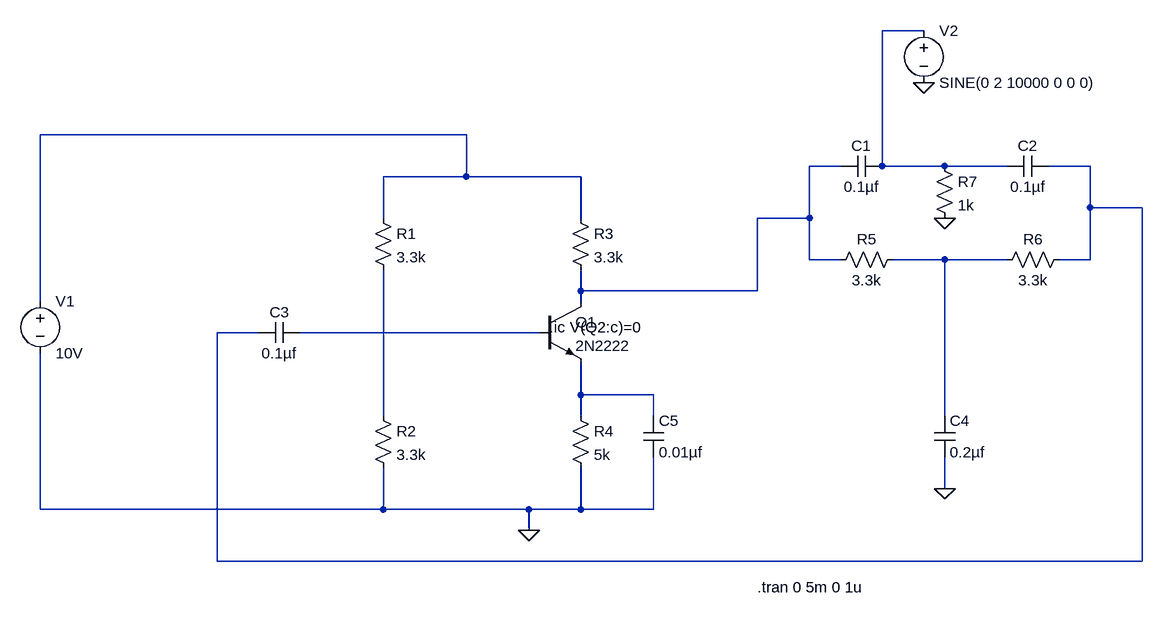
[diagram p0: schematic twin t oscillator.asc]
twin t oscillator.asc, the LTspice schematic file:
Version 4.1
SHEET 1 1504 680
WIRE 1024 -208 960 -208
WIRE 320 -48 -336 -48
WIRE 896 0 848 0
WIRE 960 0 960 -208
WIRE 1056 0 960 0
WIRE 1152 0 1056 0
WIRE 1280 0 1216 0
WIRE 320 16 320 -48
WIRE 320 16 192 16
WIRE 496 16 320 16
WIRE 1280 64 1280 0
WIRE 1360 64 1280 64
WIRE 192 80 192 16
WIRE 496 80 496 16
WIRE 848 80 848 0
WIRE 848 80 768 80
WIRE 848 144 848 80
WIRE 896 144 848 144
WIRE 1056 144 976 144
WIRE 1152 144 1056 144
WIRE 1280 144 1280 64
WIRE 1280 144 1232 144
WIRE 496 192 496 160
WIRE 768 192 768 80
WIRE 768 192 496 192
WIRE -336 208 -336 -48
WIRE 496 208 496 192
WIRE 0 256 -64 256
WIRE 432 256 64 256
WIRE 496 352 496 304
WIRE 608 352 496 352
WIRE 192 384 192 160
WIRE 496 384 496 352
WIRE 608 384 608 352
WIRE 1056 384 1056 144
WIRE 1056 496 1056 448
WIRE -336 528 -336 288
WIRE 192 528 192 464
WIRE 192 528 -336 528
WIRE 416 528 192 528
WIRE 496 528 496 464
WIRE 496 528 416 528
WIRE 608 528 608 448
WIRE 608 528 496 528
WIRE 416 560 416 528
WIRE -64 608 -64 256
WIRE 1360 608 1360 64
WIRE 1360 608 -64 608
FLAG 416 560 0
FLAG 1056 80 0
FLAG 1056 496 0
FLAG 1024 -128 0
SYMBOL res 176 64 R0
SYMATTR InstName R1
SYMATTR Value 3.3k
SYMBOL res 176 368 R0
SYMATTR InstName R2
SYMATTR Value 3.3k
SYMBOL res 480 64 R0
SYMATTR InstName R3
SYMATTR Value 3.3k
SYMBOL res 480 368 R0
SYMATTR InstName R4
SYMATTR Value 5k
SYMBOL res 992 128 R90
WINDOW 0 0 56 VBottom 2
WINDOW 3 32 56 VTop 2
SYMATTR InstName R5
SYMATTR Value 3.3k
SYMBOL res 1248 128 R90
WINDOW 0 0 56 VBottom 2
WINDOW 3 32 56 VTop 2
SYMATTR InstName R6
SYMATTR Value 3.3k
SYMBOL cap 960 -16 R90
WINDOW 0 0 32 VBottom 2
WINDOW 3 32 32 VTop 2
SYMATTR InstName C1
SYMATTR Value 0.1µf
SYMBOL cap 1216 -16 R90
WINDOW 0 0 32 VBottom 2
WINDOW 3 32 32 VTop 2
SYMATTR InstName C2
SYMATTR Value 0.1µf
SYMBOL cap 0 272 R270
WINDOW 0 32 32 VTop 2
WINDOW 3 0 32 VBottom 2
SYMATTR InstName C3
SYMATTR Value 0.1µf
SYMBOL cap 1040 384 R0
SYMATTR InstName C4
SYMATTR Value 0.2µf
SYMBOL cap 592 384 R0
SYMATTR InstName C5
SYMATTR Value 0.01µf
SYMBOL voltage -336 192 R0
SYMATTR InstName V1
SYMATTR Value 10V
SYMBOL npn 432 208 R0
SYMATTR InstName Q1
SYMATTR Value 2N2222
SYMBOL res 1040 -16 R0
SYMATTR InstName R7
SYMATTR Value 1k
SYMBOL voltage 1024 -224 R0
WINDOW 123 0 0 Left 0
WINDOW 39 0 0 Left 0
SYMATTR InstName V2
SYMATTR Value SINE(0 2 10000 0 0 0)
TEXT 448 248 Left 2 !.ic V(Q2:c)=0
TEXT 768 648 Left 2 !.tran 0 5m 0 1u

The netlist it stands for:
* twin t oscillator.asc
R1 N002 N008 3.3k
R2 N008 0 3.3k
R3 N002 N003 3.3k
R4 N007 0 5k
R5 N005 N003 3.3k
R6 N004 N005 3.3k
C1 N001 N003 0.1µf
C2 N004 N001 0.1µf
C3 N004 N006 0.1µf
C4 N005 0 0.2µf
C5 N007 0 0.01µf
V1 N002 0 10V
Q1 N003 N006 N007 0 2N2222
R7 N001 0 1k
V2 N001 0 SINE(0 2 10000 0 0 0)
.model NPN NPN
.model PNP PNP
.lib standard.bjt
.ic V(Q2:c)=0
.tran 0 5m 0 1u
.backanno
.end